# EAGLE design clock-power-module (EAGLE 9.5.2)

## Sheet 1 of 2
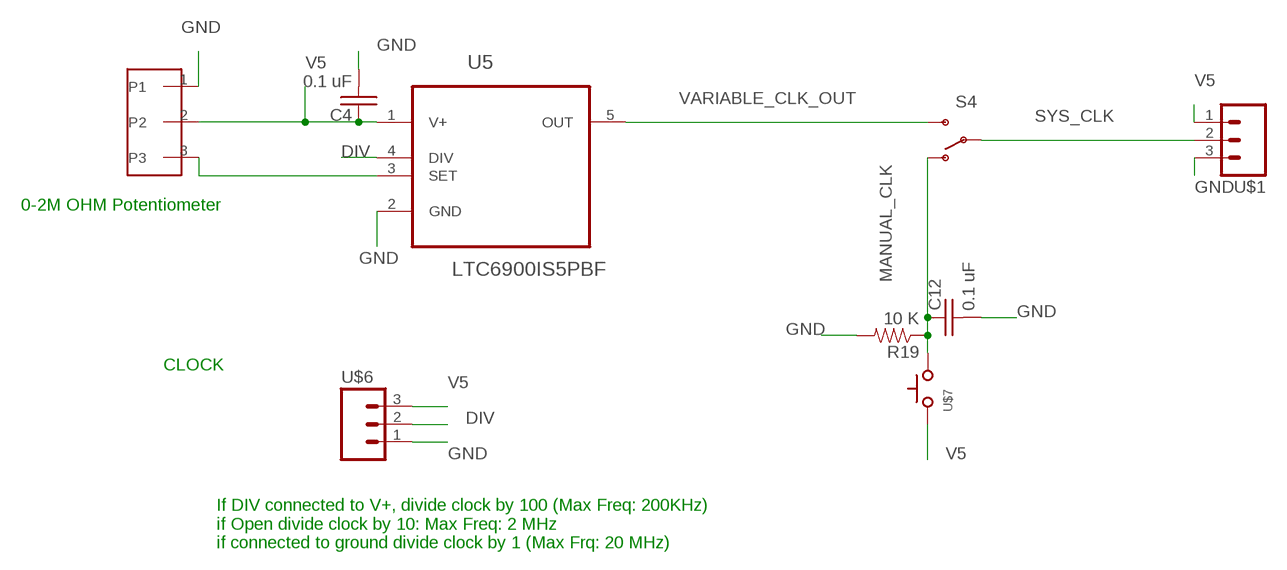
[diagram p0: schematic, sheet 1]

### Parts
C4  0.1 uF  C-USC0805K  [C0805K]
C12  0.1 uF  C-USC0805K  [C0805K]
R19  10 K  RESISTOR0805-RES  [0805]
S4  SWITCH-SPSTKIT  [SWITCH-SPDT_KIT]
U5  LTC6900IS5PBF  [SOT95P280X100-5N]
U$1  M03  [1X03_UDPI]
U$3  POTENTIOMETER  [SCREW-TERM-EP]
U$6  M03  [1X03_UDPI]
U$7  SWITCH_TACTILETACTILE-2PIN-NARROW  [TACTILE-2PIN-NARROW]

### Nets
DIV: U5.4(DIV) U$6.2
GND: C4.2 C12.2 R19.2 U5.2(GND) U$1.3 U$3.1 U$6.1 ; also sheet 2
MANUAL_CLK: C12.1 R19.1 S4.1(O) U$7.P$1(A)
N$22: U5.3(SET) U$3.3
SYS_CLK: S4.2(P) U$1.2
V5: C4.1 U5.1(V+) U$1.1 U$3.2 U$6.3 U$7.P$2(C) ; also sheet 2
VARIABLE_CLK_OUT: S4.3(S) U5.5(OUT)

### Notes on the sheet
- 0-2M OHM Potentiometer
- CLOCK
- If DIV connected to V+, divide clock by 100 (Max Freq: 200KHz)
  if Open divide clock by 10: Max Freq: 2 MHz
  if connected to ground divide clock by 1 (Max Frq: 20 MHz)

## Sheet 2 of 2
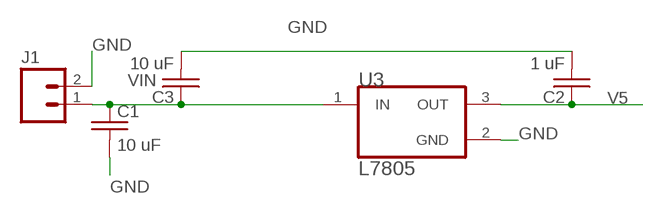
[diagram p1: schematic, sheet 2]

### Parts
C1  10 uF  C-USC0805K  [C0805K]
C2  1 uF  C-USC0805K  [C0805K]
C3  10 uF  C-USC0805K  [C0805K]
J1  M02PTH3  [1X02_LONGPADS]
U3  L7805  [TO-220-3]

### Nets
GND: C1.2 C2.2 C3.2 J1.2 U3.2(GND) ; also sheet 1
V5: C2.1 U3.3(OUT) ; also sheet 1
VIN: C1.1 C3.1 J1.1 U3.1(IN)

## Library data of the parts
C1-C4 C12 = passives:C-US: CAPACITOR, American symbol
J1 = connector:M02: Standard 2-pin 0.1" header. Use with - straight break away headers ( PRT-00116) - right angle break away headers (PRT-00553) - swiss pins (PRT-00743) - machine pins (PRT-00117) - female headers (PRT-00115) Molex polarized connector foot print use with: PRT-08233 with associated crimp pins and housings. 2.54_SCREWTERM for use with PRT-10571. 3.5mm Screw Terminal footprints for PRT-08084 5mm Screw Terminal footprints for use with PRT-08432
R19 = passives:RESISTOR: Resistor Basic schematic elements and footprints for 0603, 1206, and PTH resistors.
S4 = switches:SWITCH-SPST: SPST Switch Simple slide switch.
U3 = voltage-regulator:L7805: IC REG LINEAR 5V 1.2A TO220AB; AVAILABILITY: Unavailable; DESCRIPTION: Linear Voltage Regulator IC 1 Output 1.2A TO-220AB; MF: STMicroelectronics; MP: L7805; PACKAGE: TO-220 Texas Instruments; PRICE: None
U5 = crystals-timing:LTC6900IS5PBF: Low Power, 1kHz to 20MHz Resistor Set SOT-23 Oscillator; AVAILABILITY: Unavailable; DESCRIPTION: Oscillator, Silicon IC 1kHz ~ 20MHz TSOT-23-5; MF: Linear Technology; MP: LTC6900IS5#PBF; PACKAGE: SOT-23-5 Linear Technology; PRICE: None
U$1 U$6 = connector:M03: Header 3 Standard 3-pin 0.1" header. Use with straight break away headers (SKU : PRT-00116), right angle break away headers (PRT-00553), swiss pins (PRT-00743), machine pins (PRT-00117), and female headers (PRT-00115). Molex polarized connector foot print use with SKU : PRT-08232 with associated crimp pins and housings.
U$3 = passives:POTENTIOMETER
U$7 = switches:SWITCH_TACTILE

## Board
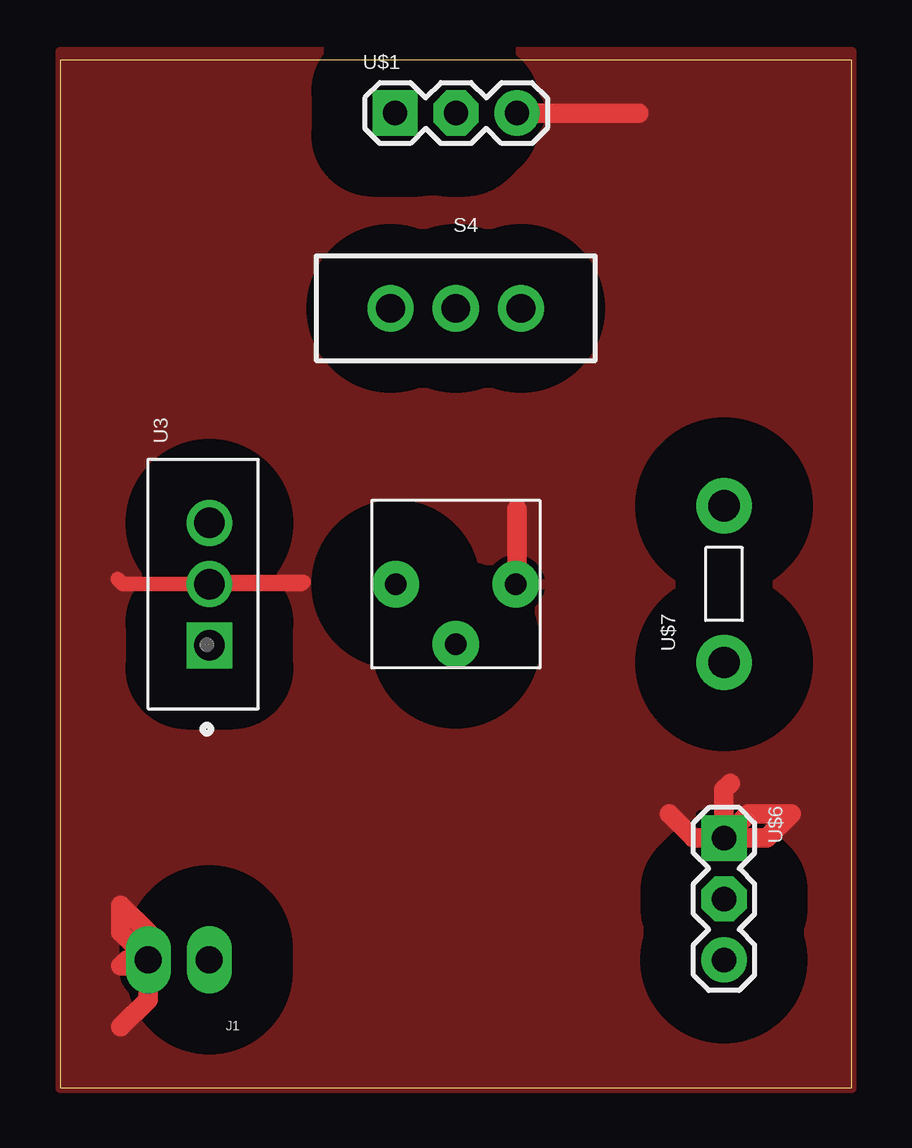
[diagram p2: board, top side]
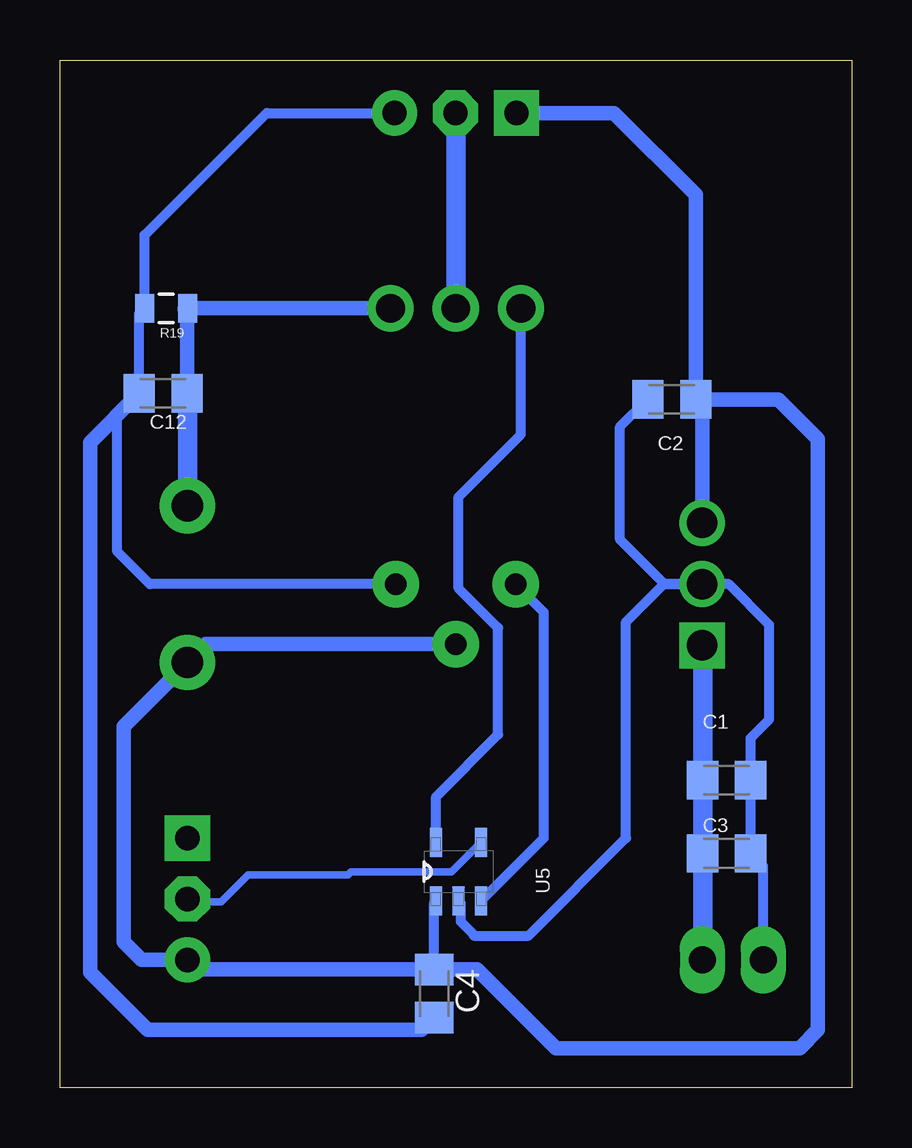
[diagram p3: board, bottom side, seen from below]

Size 33 x 42.85 mm. Coordinates in mm from the lower left corner, seen from the top.
Outline: 0,0 33,0 33,42.85 0,42.85 0,0
Copper layers (1*16): Top 0.035mm / dielectric 1.5mm / Bottom 0.035mm
Design rules "OthermillDRC_1_64_v2": minimum track width 16mil, minimum drill 31mil, track to track 0.39878125mm, track to pad 0.39878125mm, pad to pad 0.39878125mm, via to via 0.39878125mm, smd to smd 0mil, copper to edge 0mil, drill to drill 1mil, minimum pad ring 0mil, minimum via ring 15mil, stop-mask expansion 1mil, vias tented up to drill 30mil, thermal gap 10mil

### Footprints (pad centres in the part's own frame; a part is rotated, then mirrored left to right if it is on the bottom)
C0805K = smd 1.3 x 1.6: 1 -1,0; 2 1,0
1X02_LONGPADS = drill 1.118 pad 1.88 long: 1 0,0; 2 2.54,0
0805 = smd 0.8 x 1.2: 1 -0.9,0; 2 0.9,0
SWITCH-SPDT_KIT = drill 1.2 pad 1.93: 1 0,2.718; 2 0,0; 3 0,-2.718
TO-220-3 = drill 1.27 pad 1.91 square: 1 -2.55,-0.26 | drill 1.27 pad 1.91: 2 0,-0.26; 3 2.55,-0.26
SOT95P280X100-5N = smd 1.219 x 0.508: 1 -1.219,0.94; 2 -1.219,0; 3 -1.219,-0.94; 4 1.219,-0.94; 5 1.219,0.94
1X03_UDPI = drill 1.016 pad 1.88 square: 1 0,0 | drill 1.016 pad 1.88 octagon: 2 2.54,0 | drill 1.016 pad 1.88: 3 5.08,0
SCREW-TERM-EP = drill 0.9 pad 1.93: 1 -2.5,0; 2 0,2.5; 3 2.5,0
TACTILE-2PIN-NARROW = drill 1.3 pad 2.3: P$1 3.264,0; P$2 -3.264,0

### Placement (x,y rotation side)
C1  5.21,12.83 0 bottom
C2  7.49,28.7 180 bottom
C3  5.21,9.78 0 bottom
C4  17.4,3.94 270 bottom
C12  28.7,28.96 180 bottom
J1  6.22,5.33 180 top
R19  28.57,32.5 180 bottom
S4  16.5,32.5 270 top
U3  5.97,21 90 top
U5  16.38,9.02 90 bottom
U$1  13.97,40.64 0 top
U$3  16.5,21 180 top
U$6  27.69,10.41 270 top
U$7  27.69,21 90 top

### Tracks (layer width: path | path; a pad name or v marks a point on that pad's centre or on a via)
DIV
  Bottom 0.305: U5.4 16.67,9.01 20.87,9.01 20.99,8.89 25.15,8.89 26.29,7.75 27.56,7.75 U$6.2
GND
  Top 0.61: U3.2 10.08,21 10.16,21.08 6.31,21.08 U3.2 | U3.2 2.62,21 2.41,21.21
  Top 0.813: U$6.1 27.69,12.45 27.94,12.7 | U$1.3 24.13,40.64 | U$3.1 19.05,21.05 19.05,24.13 | J1.2 3.43,5.08 2.54,5.08 2.79,5.33 J1.2 | J1.2 2.54,6.48 2.54,7.62 3.68,6.48 J1.2 | J1.2 3.68,3.68 2.54,2.54 | U$6.1 28.7,11.43 30.48,11.43 29.46,10.41 U$6.1 | U$6.1 26.42,10.41 25.4,11.43
  Bottom 0.406: J1.2 3.68,9.26 C3.2 C1.2 4.21,14.59 3.43,15.37 3.43,19.3 5.12,21 U3.2 | U$1.3 24.38,40.64 29.48,35.55 R19.2 29.7,32.27 C12.2 30.61,28.05 30.61,22.35 29.25,21 U$3.1 | U5.2 16.3,7.71 16.3,6.94 15.75,6.39 15.75,6.35 13.46,6.35 9.4,10.41 9.4,19.43 7.83,21 U3.2 | U3.2 7.79,21 9.65,22.86 9.65,27.56 8.51,28.7 C2.2
  Bottom 0.61: C4.2 17.92,2.41 29.34,2.41 31.75,4.83 31.75,26.91 C12.2
  pour Top (isolate 2.54): 0,43.18 0,0 33.02,0 33.02,43.18 1.27,43.18
MANUAL_CLK
  Bottom 0.61: S4.1 R19.1 | C12.1 27.7,32.47
  Bottom 0.813: U$7.P$1 27.69,28.94 C12.1 | 27.7,32.47 R19.1
N$22
  Bottom 0.406: U5.3 12.83,10.41 12.83,19.83 U$3.3
SYS_CLK
  Bottom 0.813: S4.2 U$1.2
V5
  Bottom 0.406: C4.1 17.4,7.72 U5.1
  Bottom 0.61: U$3.2 26.92,18.5 U$7.P$2 30.35,15.07 30.35,6.1 29.59,5.33 U$6.3 27.29,4.94 C4.1 15.61,4.94 12.32,1.65 2.16,1.65 1.4,2.41 1.4,27.05 3.05,28.7 C2.1 | U3.3 6.23,28.44 C2.1 | C2.1 6.49,37.23 9.91,40.64 U$1.1
VARIABLE_CLK_OUT
  Bottom 0.406: U5.5 17.32,12.14 14.73,14.73 14.73,19.18 16.38,20.83 16.38,24.64 13.78,27.24 S4.3
VIN
  Bottom 0.813: J1.1 6.21,5.35 C3.1 C1.1 6.21,18.43 U3.1